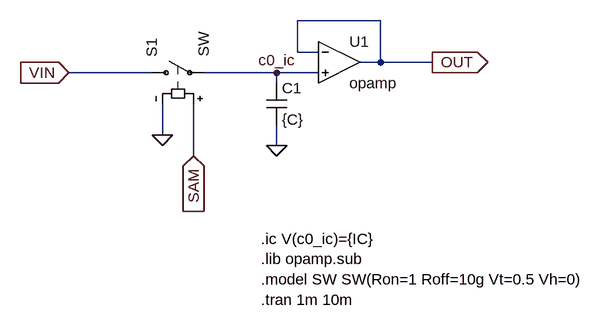
[diagram p0: schematic COM_SampleAndHold.asc]
COM_SampleAndHold.asc, the LTspice schematic file:
Version 4
SHEET 1 880 680
WIRE 496 192 368 192
WIRE 368 240 368 192
WIRE 400 240 368 240
WIRE 496 256 496 192
WIRE 496 256 464 256
WIRE 576 256 496 256
WIRE 144 272 16 272
WIRE 336 272 224 272
WIRE 400 272 336 272
WIRE 336 288 336 272
WIRE 160 368 160 320
WIRE 336 384 336 352
WIRE 208 400 208 320
FLAG 336 384 0
FLAG 160 368 0
FLAG 576 256 OUT
IOPIN 576 256 Out
FLAG 208 400 SAM
IOPIN 208 400 In
FLAG 16 272 VIN
IOPIN 16 272 In
FLAG 336 272 c0_ic
SYMBOL Opamps/opamp 432 192 R0
SYMATTR InstName U1
SYMBOL sw 128 272 R270
SYMATTR InstName S1
SYMBOL cap 320 288 R0
SYMATTR InstName C1
SYMATTR Value {C}
TEXT 312 528 Left 2 !.ic V(c0_ic)={IC}\n.lib opamp.sub\n.model SW SW(Ron=1 Roff=10g Vt=0.5 Vh=0)\n.tran 1m 10m

The netlist it stands for:
* COM_SampleAndHold.asc
XU1 OUT c0_ic OUT opamp Aol=100K GBW=10Meg  ; pins invin noninvin out
S1 VIN c0_ic SAM 0 SW
C1 c0_ic 0 {C}
.ic V(c0_ic)={IC}
.lib opamp.sub
.model SW SW(Ron=1 Roff=10g Vt=0.5 Vh=0)
.tran 1m 10m
.backanno
.end